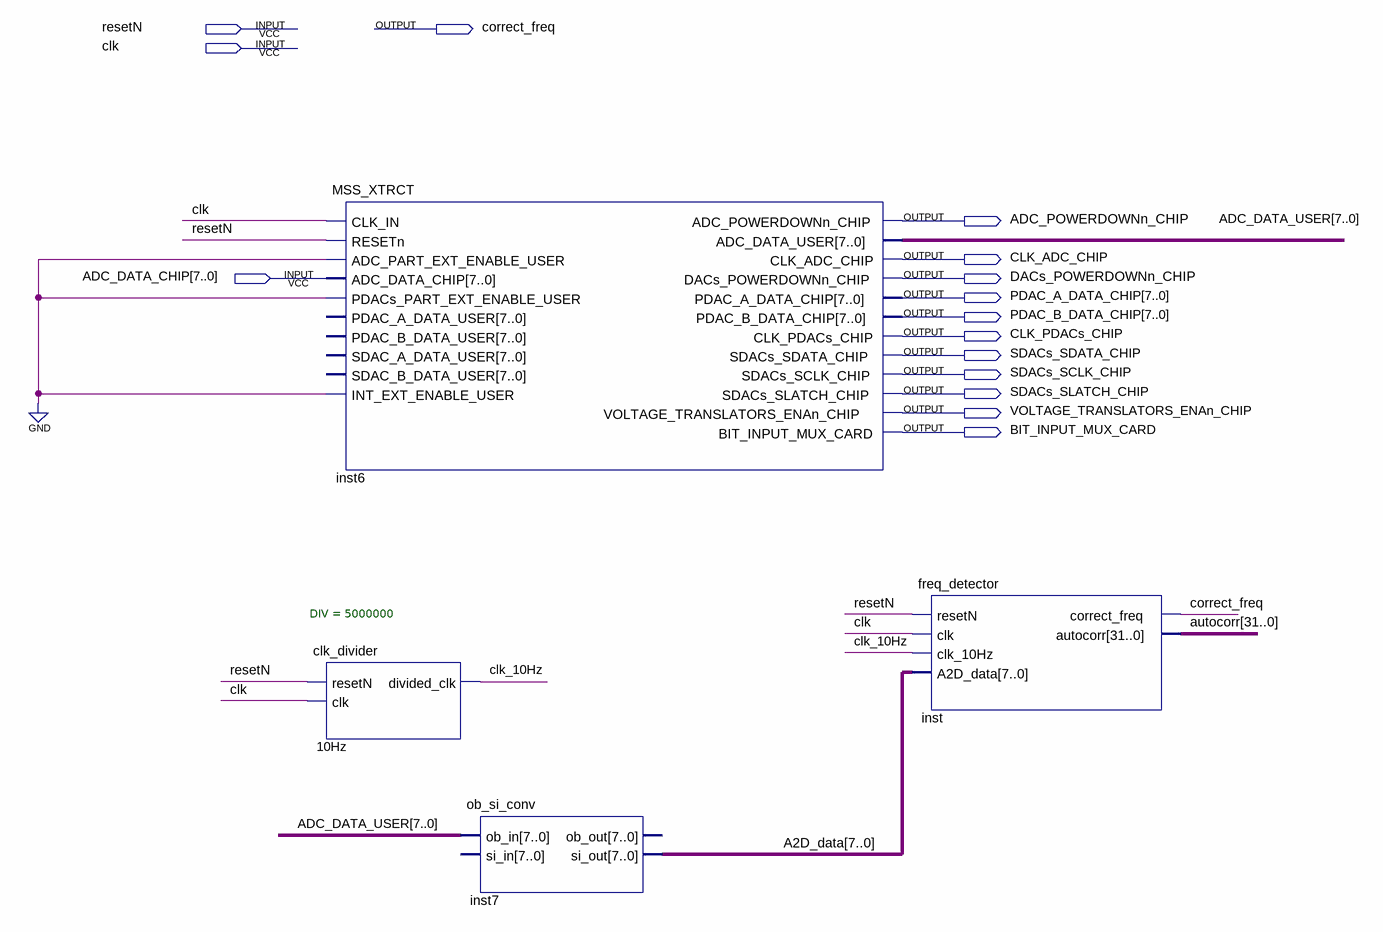
[diagram p0: schematic sheet]
// Quartus schematic freq_detector_mss.bdf as structural Verilog: 4 symbols, 15 pins
module freq_detector_mss (
  input  resetN,
  input  clk,
  input  [7:0] ADC_DATA_CHIP,
  output correct_freq,
  output ADC_POWERDOWNn_CHIP,
  output CLK_ADC_CHIP,
  output DACs_POWERDOWNn_CHIP,
  output [7:0] PDAC_A_DATA_CHIP,
  output [7:0] PDAC_B_DATA_CHIP,
  output CLK_PDACs_CHIP,
  output SDACs_SDATA_CHIP,
  output SDACs_SCLK_CHIP,
  output SDACs_SLATCH_CHIP,
  output VOLTAGE_TRANSLATORS_ENAn_CHIP,
  output BIT_INPUT_MUX_CARD
);

  wire clk_10Hz;
  wire [7:0] A2D_data, ADC_DATA_USER;
  wire [31:0] autocorr;

  MSS_XTRCT inst6 (
    .CLK_IN(clk), .RESETn(resetN), .ADC_PART_EXT_ENABLE_USER(1'b0), .ADC_DATA_CHIP(ADC_DATA_CHIP),
    .PDACs_PART_EXT_ENABLE_USER(1'b0), .INT_EXT_ENABLE_USER(1'b0), .ADC_POWERDOWNn_CHIP(ADC_POWERDOWNn_CHIP),
    .ADC_DATA_USER(ADC_DATA_USER), .CLK_ADC_CHIP(CLK_ADC_CHIP), .DACs_POWERDOWNn_CHIP(DACs_POWERDOWNn_CHIP),
    .PDAC_A_DATA_CHIP(PDAC_A_DATA_CHIP), .PDAC_B_DATA_CHIP(PDAC_B_DATA_CHIP),
    .CLK_PDACs_CHIP(CLK_PDACs_CHIP), .SDACs_SDATA_CHIP(SDACs_SDATA_CHIP), .SDACs_SCLK_CHIP(SDACs_SCLK_CHIP),
    .SDACs_SLATCH_CHIP(SDACs_SLATCH_CHIP), .VOLTAGE_TRANSLATORS_ENAn_CHIP(VOLTAGE_TRANSLATORS_ENAn_CHIP),
    .BIT_INPUT_MUX_CARD(BIT_INPUT_MUX_CARD));  // open: PDAC_A_DATA_USER, PDAC_B_DATA_USER, SDAC_A_DATA_USER, SDAC_B_DATA_USER
  clk_divider #(.DIV(5000000)) u_10Hz (.resetN(resetN), .clk(clk), .divided_clk(clk_10Hz));
  ob_si_conv inst7 (.ob_in(ADC_DATA_USER), .si_out(A2D_data));  // open: si_in, ob_out
  freq_detector inst (
    .resetN(resetN), .clk(clk), .clk_10Hz(clk_10Hz), .A2D_data(A2D_data), .correct_freq(correct_freq),
    .autocorr(autocorr));
endmodule
